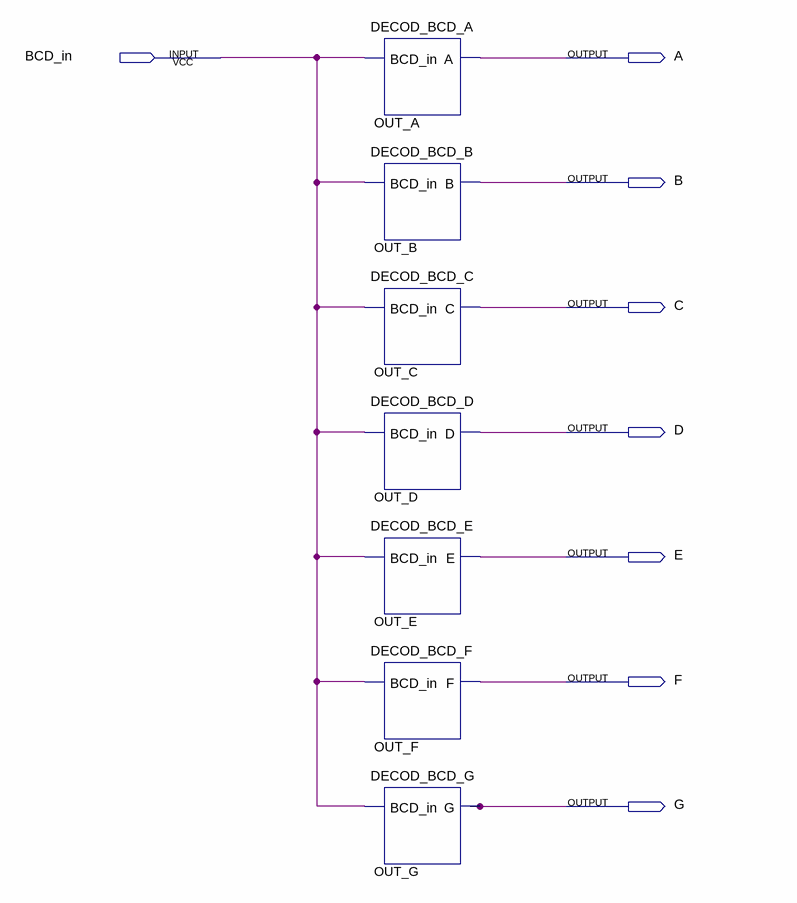
[diagram p0: schematic sheet]
// Quartus schematic DECOD_BCD_1b.bdf as structural Verilog: 7 symbols, 8 pins
module DECOD_BCD_1b (
  input  BCD_in,
  output A,
  output B,
  output C,
  output D,
  output E,
  output F,
  output G
);

  DECOD_BCD_A OUT_A (.BCD_in(BCD_in), .A(A));
  DECOD_BCD_B OUT_B (.BCD_in(BCD_in), .B(B));
  DECOD_BCD_C OUT_C (.BCD_in(BCD_in), .C(C));
  DECOD_BCD_D OUT_D (.BCD_in(BCD_in), .D(D));
  DECOD_BCD_E OUT_E (.BCD_in(BCD_in), .E(E));
  DECOD_BCD_F OUT_F (.BCD_in(BCD_in), .F(F));
  DECOD_BCD_G OUT_G (.BCD_in(BCD_in), .G(G));
endmodule
